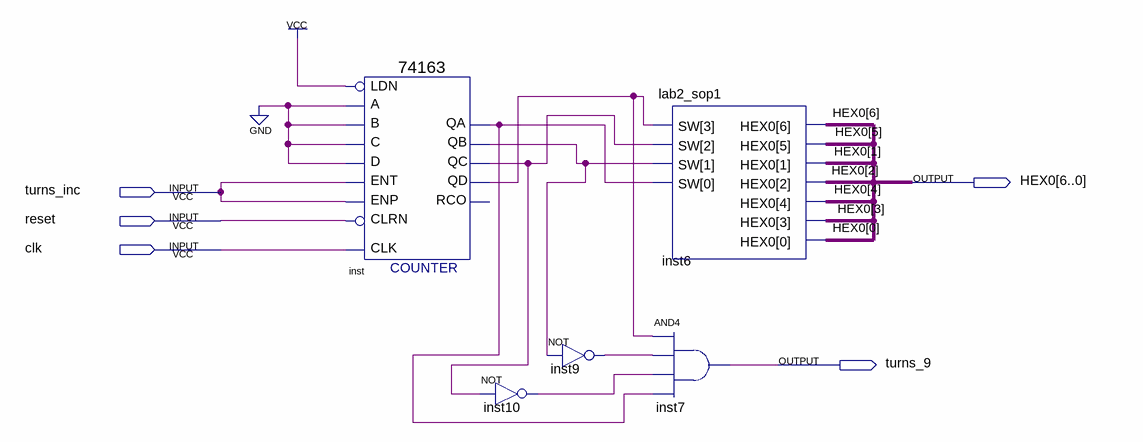
[diagram p0: schematic sheet]
// Quartus schematic turn_counter.bdf as structural Verilog: 5 symbols, 5 pins
module turn_counter (
  input  turns_inc,
  input  reset,
  input  clk,
  output [6:0] HEX0,
  output turns_9
);

  wire inst9_out, inst10_out, inst_qa, inst_qb, inst_qc, inst_qd;

  \74163  inst (
    .C(1'b0), .B(1'b0), .A(1'b0), .ENT(turns_inc), .D(1'b0), .CLRN(reset), .CLK(clk), .ENP(turns_inc),
    .LDN(1'b1), .QA(inst_qa), .QB(inst_qb), .QC(inst_qc), .QD(inst_qd));  // open: RCO
  not inst10 (inst10_out, inst_qc);
  not inst9 (inst9_out, inst_qb);
  lab2_sop1 inst6 (.SW({inst_qd, inst_qc, inst_qb, inst_qa}), .HEX0(HEX0));
  and inst7 (turns_9, inst_qd, inst9_out, inst10_out, inst_qa);
endmodule
